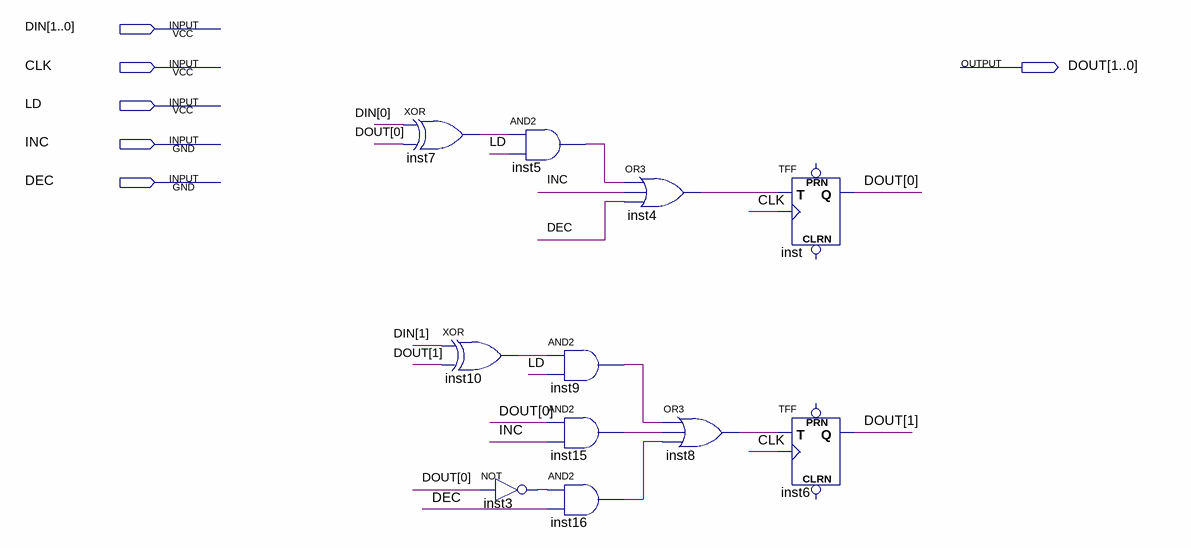
[diagram p0: schematic sheet]
// Quartus schematic REG2_LD_INC_DEC.bdf as structural Verilog: 11 symbols, 6 pins
module REG2_LD_INC_DEC (
  input  [1:0] DIN,
  input  CLK,
  input  LD,
  input  INC,
  input  DEC,
  output [1:0] DOUT
);

  wire inst3_out, inst4_out, inst5_out, inst7_out, inst8_out, inst9_out, inst10_out, inst15_out, inst16_out;

  xor inst7 (inst7_out, DIN[0], DOUT[0]);
  xor inst10 (inst10_out, DIN[1], DOUT[1]);
  and inst5 (inst5_out, inst7_out, LD);
  and inst9 (inst9_out, inst10_out, LD);
  and inst15 (inst15_out, DOUT[0], INC);
  and inst16 (inst16_out, inst3_out, DEC);
  not inst3 (inst3_out, DOUT[0]);
  or inst4 (inst4_out, inst5_out, INC, DEC);
  or inst8 (inst8_out, inst9_out, inst15_out, inst16_out);
  TFF inst (.T(inst4_out), .CLK(CLK), .Q(DOUT[0]));  // open: PRN, CLRN
  TFF inst6 (.T(inst8_out), .CLK(CLK), .Q(DOUT[1]));  // open: PRN, CLRN
endmodule
